# Altium schematic sheet DSP's.SchDoc
size A4
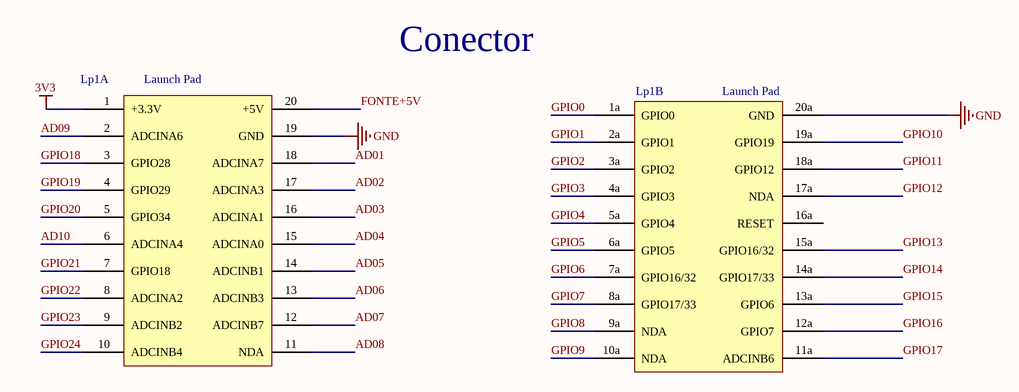
[diagram p0: DSP's.SchDoc]

## Parts
Lp1  Launch Pad  [LAUNCHPAD_28xxx]  (parts A,B of 2)

## Nets
3V3: Lp1.1(+3.3V)
GND: Lp1.19(GND) Lp1.20a(GND)
AD01: Lp1.18(ADCINA7)
AD02: Lp1.17(ADCINA3)
AD03: Lp1.16(ADCINA1)
AD04: Lp1.15(ADCINA0)
AD05: Lp1.14(ADCINB1)
AD06: Lp1.13(ADCINB3)
AD07: Lp1.12(ADCINB7)
AD08: Lp1.11(NDA)
AD09: Lp1.2(ADCINA6)
AD10: Lp1.6(ADCINA4)
FONTE+5V: Lp1.20(+5V)
GPIO0: Lp1.1a(GPIO0)
GPIO1: Lp1.2a(GPIO1)
GPIO2: Lp1.3a(GPIO2)
GPIO3: Lp1.4a(GPIO3)
GPIO4: Lp1.5a(GPIO4)
GPIO5: Lp1.6a(GPIO5)
GPIO6: Lp1.7a(GPIO16/32)
GPIO7: Lp1.8a(GPIO17/33)
GPIO8: Lp1.9a(NDA)
GPIO9: Lp1.10a(NDA)
GPIO10: Lp1.19a(GPIO19)
GPIO11: Lp1.18a(GPIO12)
GPIO12: Lp1.17a(NDA)
GPIO13: Lp1.15a(GPIO16/32)
GPIO14: Lp1.14a(GPIO17/33)
GPIO15: Lp1.13a(GPIO6)
GPIO16: Lp1.12a(GPIO7)
GPIO17: Lp1.11a(ADCINB6)
GPIO18: Lp1.3(GPIO28)
GPIO19: Lp1.4(GPIO29)
GPIO20: Lp1.5(GPIO34)
GPIO21: Lp1.7(GPIO18)
GPIO22: Lp1.8(ADCINA2)
GPIO23: Lp1.9(ADCINB2)
GPIO24: Lp1.10(ADCINB4)

Not connected (* = marked no-connect by the designer): Lp1 16a(RESET)

## Notes on the sheet
- Conector

## Library data of the parts
Lp1 = LaunchPad_28xxx